# EAGLE schematic lab2 (EAGLE 9.6.2)
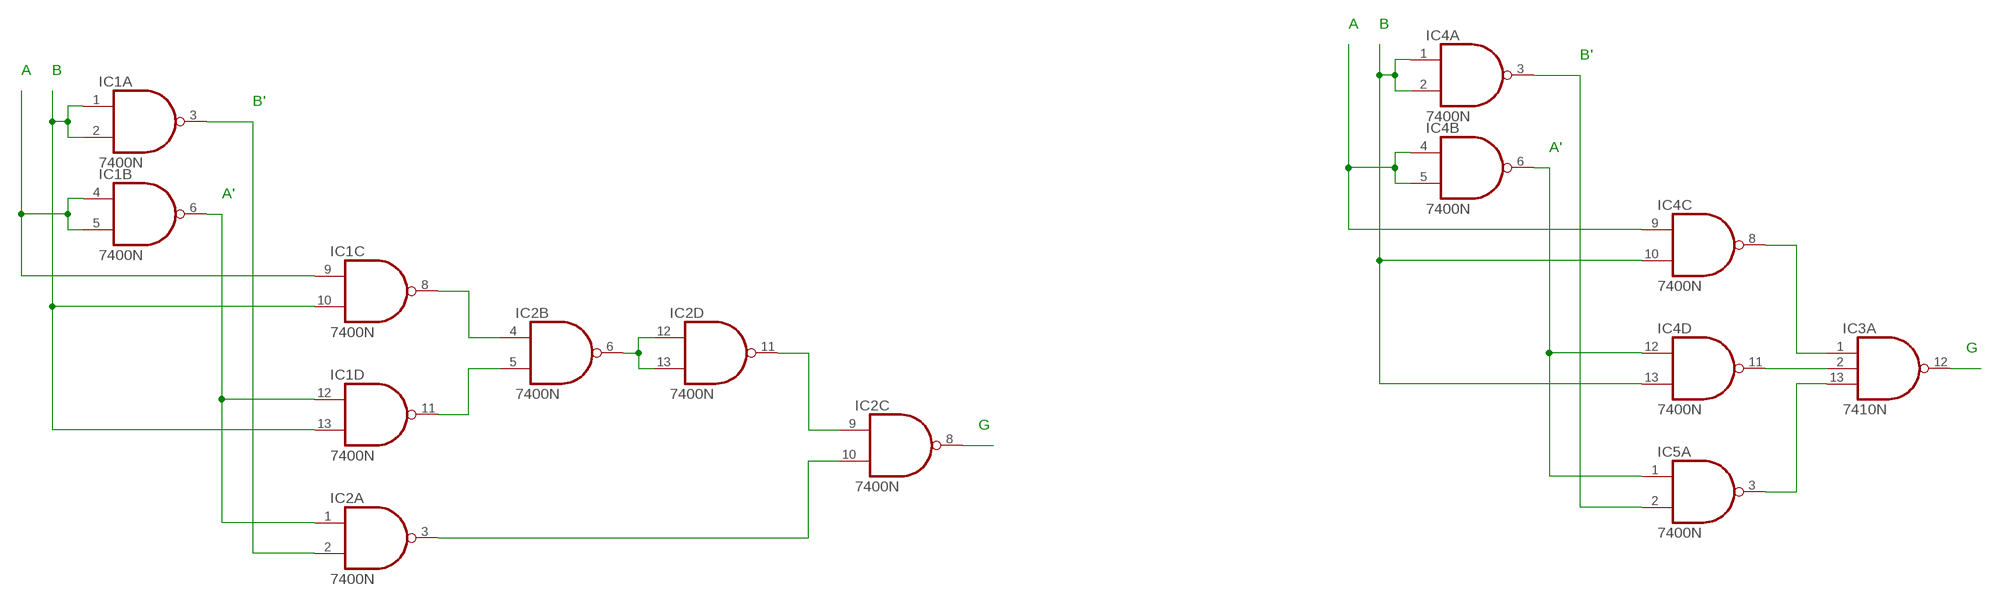
[diagram p0: schematic, sheet 1]

## Parts
IC1  7400N  [DIL14]
IC2  7400N  [DIL14]
IC3  7410N  [DIL14]
IC4  7400N  [DIL14]
IC5  7400N  [DIL14]

## Nets
N$1: IC1.6(B:O) IC1.12(D:I0) IC2.1(A:I0)
N$2: IC1.3(A:O) IC2.2(A:I1)
N$3: IC1.8(C:O) IC2.4(B:I0)
N$4: IC1.11(D:O) IC2.5(B:I1)
N$5: IC1.1(A:I0) IC1.2(A:I1) IC1.10(C:I1) IC1.13(D:I1)
N$6: IC1.4(B:I0) IC1.5(B:I1) IC1.9(C:I0)
N$7: IC2.9(C:I0) IC2.11(D:O)
N$8: IC2.3(A:O) IC2.10(C:I1)
N$9: IC2.6(B:O) IC2.12(D:I0) IC2.13(D:I1)
N$10: IC4.6(B:O) IC4.12(D:I0) IC5.1(A:I0)
N$11: IC4.3(A:O) IC5.2(A:I1)
N$12: IC4.1(A:I0) IC4.2(A:I1) IC4.10(C:I1) IC4.13(D:I1)
N$13: IC4.4(B:I0) IC4.5(B:I1) IC4.9(C:I0)
N$14: IC3.1(A:I0) IC4.8(C:O)
N$15: IC3.2(A:I1) IC4.11(D:O)
N$16: IC3.13(A:I2) IC5.3(A:O)
N$17: IC2.8(C:O)
N$18: IC3.12(A:O)
Unconnected: IC3.3(B:I0) IC3.4(B:I1) IC3.5(B:I2) IC3.6(B:O) IC3.8(C:O) IC3.9(C:I0) IC3.10(C:I1) IC3.11(C:I2) IC5.4(B:I0) IC5.5(B:I1) IC5.6(B:O) IC5.8(C:O) IC5.9(C:I0) IC5.10(C:I1) IC5.11(D:O) IC5.12(D:I0) IC5.13(D:I1)

## Notes on the sheet
- A | B
- B'
- A | B
- B'
- A'
- A'
- G
- G

## Power pins joined to a net without a drawn wire
GND: IC1.7(P:GND) IC2.7(P:GND) IC3.7(P:GND) IC4.7(P:GND) IC5.7(P:GND)
VCC: IC1.14(P:VCC) IC2.14(P:VCC) IC3.14(P:VCC) IC4.14(P:VCC) IC5.14(P:VCC)

## Library data of the parts
IC1 IC2 IC4 IC5 = AAA74xx-us:74*00: Quad 2-input NAND gate
IC3 = AAA74xx-us:74*10: Triple 3-input NAND gate